# EAGLE schematic L3DCube_X16_Daughterboard (EAGLE 7.2.0)
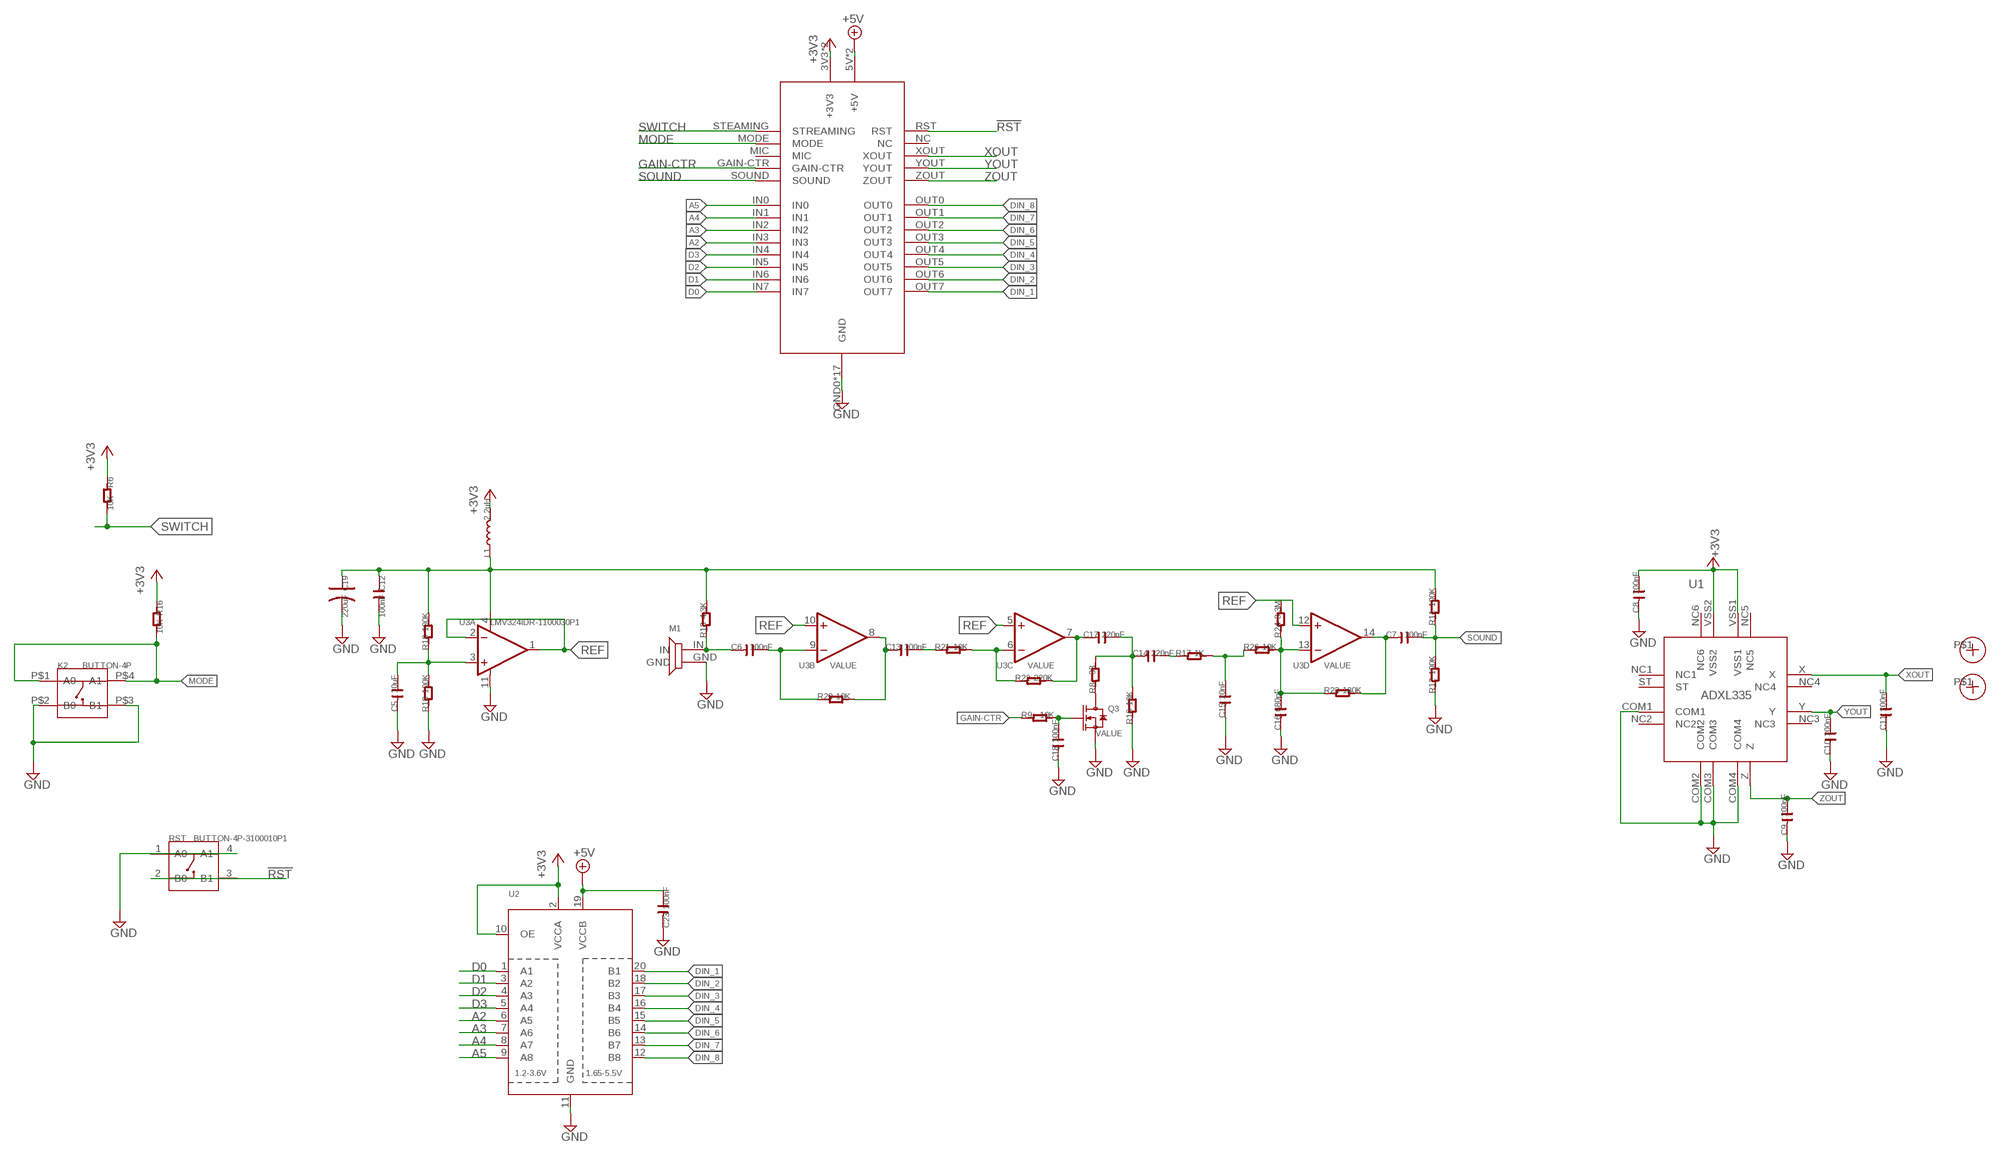
[diagram p0: schematic, sheet 1]

## Parts
C5  10uF  C-0603  [C0603]
C6  100nF  C-0603  [C0603]
C7  100nF  C-0603  [C0603]
C8  100nF  C-0603  [C0603]
C9  100nF  C-0603  [C0603]
C10  100nF  C-0603  [C0603]
C11  100nF  C-0603  [C0603]
C12  100nF  C-0603  [C0603]
C13  100nF  C-0603  [C0603]
C14  220nF  C-0603  [C0603]
C15  10nF  C-0603  [C0603]
C16  680pF  C-0603  [C0603]
C17  220nF  C-0603  [C0603]
C18  100nF  C-0603  [C0603]
C19  220uF  C-POLAR-B  [AVX-B]
C23  100nF  C-0603  [C0603]
K2  BUTTON-4P  [4P-12X12X6-SMD]
L1  2.2uH  L-0603  [L0603]
M1  MICROPHONE  [MICROPHONE]
Q3  2N7002  MOSFET-N-044020001  [SOT23]
R6  10K  R-0603  [R0603]
R8  33  R-0603  [R0603]
R9  10K  R-0603  [R0603]
R10  10K  R-0603  [R0603]
R11  100K  R-0603  [R0603]
R12  100K  R-0603  [R0603]
R13  4.3K  R-0603  [R0603]
R16  10K  R-0603  [R0603]
R17  1K  R-0603  [R0603]
R18  100K  R-0603  [R0603]
R19  100K  R-0603  [R0603]
R20  10K  R-0603  [R0603]
R21  10K  R-0603  [R0603]
R22  220K  R-0603  [R0603]
R23  180K  R-0603  [R0603]
R24  3.3M  R-0603  [R0603]
R26  10K  R-0603  [R0603]
RST  BUTTON-4P-3100010P1  [4P-SMD-6.0X6.0X5.0H]
U1  ADXL335  [ADXL335]
U2  TXB0108PWR  [TSSOP20]
U3  LMV324IDR-1100030P1  [SOIC14]
U$1  CUBE-16-DAUGHTERBOARD  [CUBE-16-DAUGHTERBOARD]
U$2  FIDUCIAL-MARK  [FIDUCIAL-MARK]
U$3  FIDUCIAL-MARK  [FIDUCIAL-MARK]

## Nets
!RST: RST.2(B0) RST.3(B1) U$1.RST
+3V3: C8.2 L1.2 R6.1 R16.1 U1.VSS1 U1.VSS2 U2.2(VCCA) U2.10(OE) U$1.3V3'(+3V3) U$1.3V3(+3V3)
+5V: C23.2 U2.19(VCCB) U$1.5V'(+5V) U$1.5V(+5V)
A2: U2.6(A5) U$1.IN3
A3: U2.7(A6) U$1.IN2
A4: U2.8(A7) U$1.IN1
A5: U2.9(A8) U$1.IN0
D0: U2.1(A1) U$1.IN7
D1: U2.3(A2) U$1.IN6
D2: U2.4(A3) U$1.IN5
D3: U2.5(A4) U$1.IN4
DIN_1: U2.20(B1) U$1.OUT7
DIN_2: U2.18(B2) U$1.OUT6
DIN_3: U2.17(B3) U$1.OUT5
DIN_4: U2.16(B4) U$1.OUT4
DIN_5: U2.15(B5) U$1.OUT3
DIN_6: U2.14(B6) U$1.OUT2
DIN_7: U2.13(B7) U$1.OUT1
DIN_8: U2.12(B8) U$1.OUT0
GAIN-CTR: R9.1 U$1.GAIN-CTR
GND [vcc]: C5.1 C8.1 C9.1 C10.1 C11.1 C12.2 C15.1 C16.1 C18.1 C19.- C23.1 K2.P$2(B0) K2.P$3(B1) M1.GND Q3.2(S) R10.1 R12.1 R19.1 RST.1(A0) RST.4(A1) U1.COM1 U1.COM2 U1.COM3 U1.COM4 U2.11(GND) U3.11(A:V-) U$1.GND0(GND) U$1.GND1(GND) U$1.GND2(GND) U$1.GND3(GND) U$1.GND4(GND) U$1.GND5(GND) U$1.GND7(GND) U$1.GND8(GND) U$1.GND9(GND) U$1.GND10(GND) U$1.GND11(GND) U$1.GND13(GND) U$1.GND14(GND) U$1.GND15(GND) U$1.GND16(GND) U$1.GND17(GND) U$1.P$37(GND)
MIC: C6.1 M1.IN R13.1
MODE: K2.P$1(A0) K2.P$4(A1) R16.2 U$1.MODE
N$32: C18.2 Q3.1(G) R9.2
N$66: Q3.3(D) R8.1
N$68: C14.2 R17.1
N$69: C15.2 R17.2 R26.1
N$70: C16.2 R23.1 R24.1 R26.2 U3.13(D:IN-)
N$96: C5.2 R18.1 R19.2 U3.3(A:IN+)
N$97: C6.2 R20.1 U3.9(B:IN-)
N$98: C13.1 R20.2 U3.8(B:OUT)
N$99: C13.2 R21.1
N$100: R21.2 R22.1 U3.6(C:IN-)
N$101: C14.1 C17.2 R8.2 R10.2
N$102: C12.1 C19.+ L1.1 R11.2 R13.2 R18.2 U3.4(A:V+)
N$104: C7.1 R23.2 U3.14(D:OUT)
N$106: C17.1 R22.2 U3.7(C:OUT)
REF: R24.2 U3.1(A:OUT) U3.2(A:IN-) U3.5(C:IN+) U3.10(B:IN+) U3.12(D:IN+)
SOUND: C7.2 R11.1 R12.2 U$1.SOUND
SWITCH: R6.2 U$1.STEAMING(STREAMING)
XOUT: C11.2 U1.X U$1.XOUT
YOUT: C10.2 U1.Y U$1.YOUT
ZOUT: C9.2 U1.Z U$1.ZOUT
Unconnected: U1.NC1 U1.NC2 U1.NC3 U1.NC4 U1.NC5 U1.NC6 U1.ST U$1.MIC U$1.NC U$2.P$1 U$3.P$1

## Library data of the parts
C5-C18 C23 = OPL Eagle Library:C*
C19 = OPL Eagle Library:C-POLAR*
K2 RST = OPL Eagle Library:BUTTON-4P
L1 = OPL Eagle Library:L*
M1 = OPL Eagle Library:MICROPHONE
Q3 = OPL Eagle Library:MOSFET-N: CJ2302：SMD MOSFET N-CH 20V-2.1A
R6 R8-R13 R16-R24 R26 = OPL Eagle Library:R*
U1 = OPL Eagle Library:ADXL335
U2 = adafruit:TXB0108PWR: 8-Bit Bi-Directional Level Shifter 1.2V-3.6V (VCCA) to 1.65V-5.5V (VCCB) bi-directional level shifter with auto direction sensing. Max data rate - VCCA 1.8V: 20Mbps (50ns), VCCA 3.3V: 100Mbps (10ns) Digikey: 296-21527-1-ND
U3 = OPL Eagle Library:LMV324IDR: General purpose LOW Voltage, Rail-to-Rail Output Amplifiers http://www.fairchildsemi.com/ds/LM/LMV358.pdf
U$1 = OPL Eagle Library:CUBE-16-DAUGHTERBOARD
U$2 U$3 = OPL Eagle Library:FIDUCIAL-MARK